# Altium project LightControl_PowerBoard.PrjPcb (part 1 of 2)
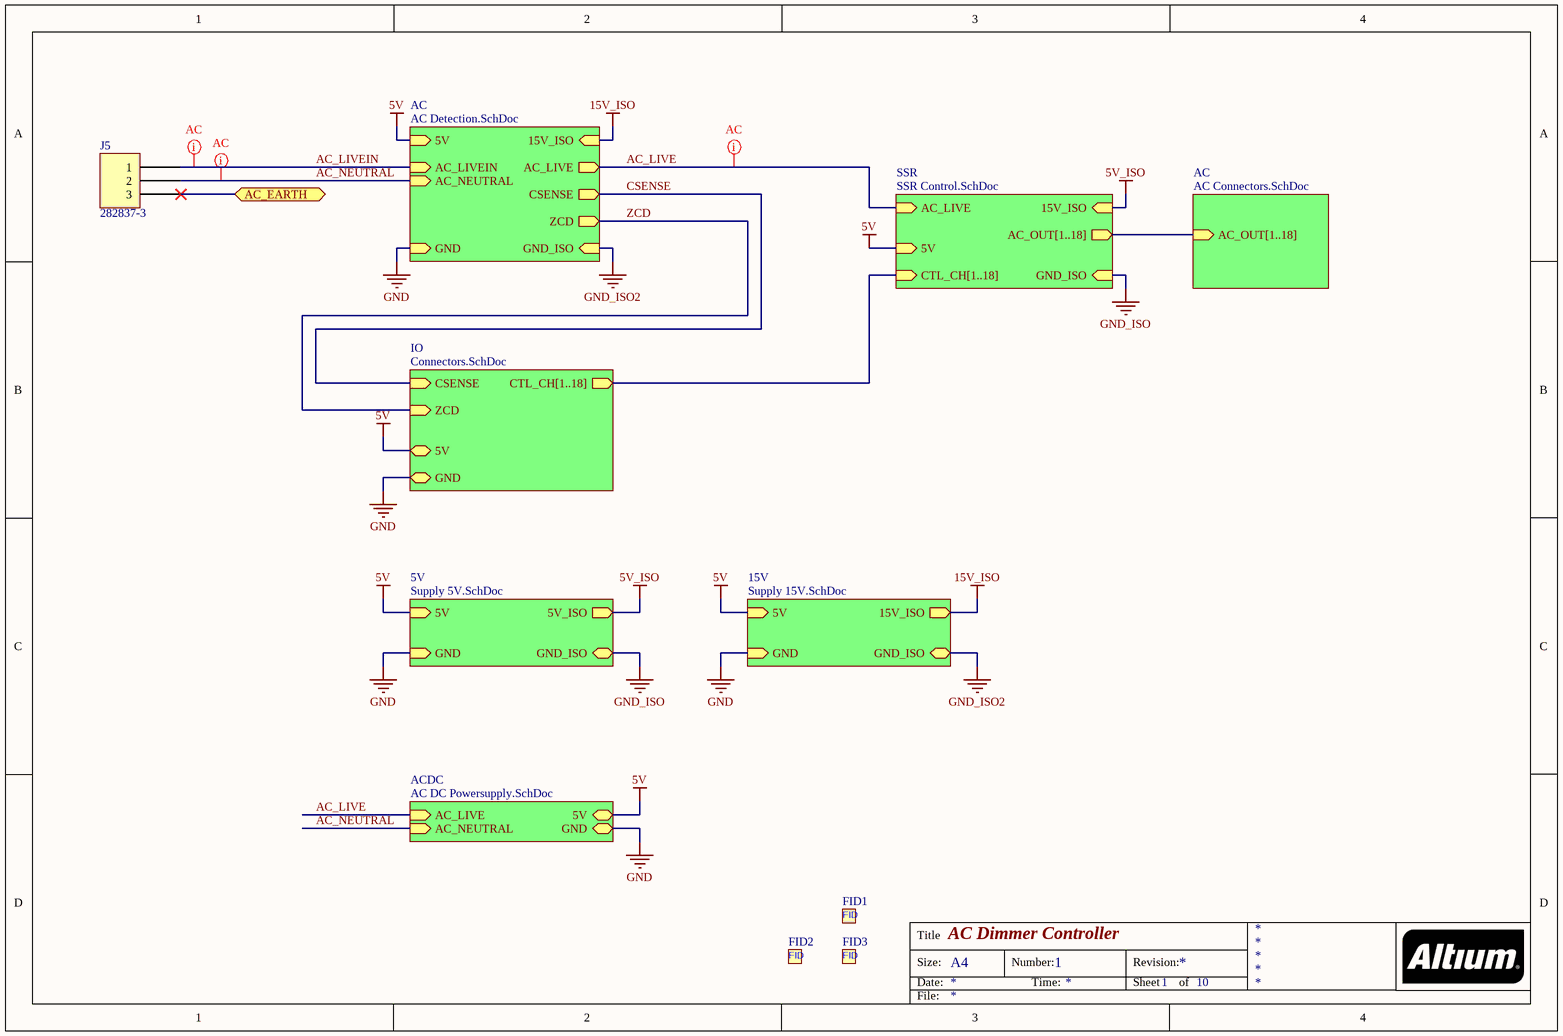
[diagram p0: Review.SchDoc]
10 sheets, 118 parts. Net scope: hierarchical (ports join the sheet entries above them; power ports are global).
Board files: LightControl_PowerBoard.PcbDoc, Power Board Panel 2 Up.PcbDoc
Sheets:
  Review.SchDoc
    AC = AC Detection.SchDoc
    5V = Supply 5V.SchDoc
    15V = Supply 15V.SchDoc
    SSR = SSR Control.SchDoc
      SSR1 = SSR.SchDoc
      SSR2 = SSR.SchDoc
      SSR3 = SSR.SchDoc
      SSR4 = SSR.SchDoc
      SSR5 = SSR.SchDoc
      SSR6 = SSR.SchDoc
      SSR7 = SSR.SchDoc
      SSR8 = SSR.SchDoc
      SSR9 = SSR.SchDoc
      SSR10 = SSR.SchDoc
      SSR11 = SSR.SchDoc
      SSR12 = SSR.SchDoc
      SSR13 = SSR.SchDoc
      SSR14 = SSR.SchDoc
      SSR15 = SSR.SchDoc
      SSR16 = SSR.SchDoc
      SSR17 = SSR.SchDoc
      SSR18 = SSR.SchDoc
      O0 = Opto.SchDoc
      O1 = Opto.SchDoc
      O2 = Opto.SchDoc
      O3 = Opto.SchDoc
      O4 = Opto.SchDoc
    AC = AC Connectors.SchDoc
    IO = Connectors.SchDoc
    ACDC = AC DC Powersupply.SchDoc

## Sheet Review.SchDoc: AC Dimmer Controller
size A4; DocumentNumber: 1; SheetNumber: 1; SheetTotal: 10

### Parts
FID1  Fiducial  [Fiducial-1mm]  (value not drawn)  (no BOM)
FID2  Fiducial  [Fiducial-1mm]  (value not drawn)  (no BOM)
FID3  Fiducial  [Fiducial-1mm]  (value not drawn)  (no BOM)
J5  282837-3  [TE 282837-3]

### Sub-sheets
5V = Supply 5V.SchDoc: GND (in), 5V (in), 5V_ISO (out), GND_ISO (bidir)
15V = Supply 15V.SchDoc: GND_ISO (bidir), 15V_ISO (out), 5V (in), GND (in)
AC = AC Detection.SchDoc: CSENSE (out), AC_LIVE (out), AC_LIVEIN (in), AC_NEUTRAL (in), ZCD (out), 15V_ISO (in), GND_ISO (in), GND (in), 5V (in)
AC = AC Connectors.SchDoc: AC_OUT[1..18] (in)
ACDC = AC DC Powersupply.SchDoc: AC_LIVE (in), AC_NEUTRAL (in), GND (bidir), 5V (bidir)
IO = Connectors.SchDoc: ZCD (in), CSENSE (in), CTL_CH[1..18] (out), 5V (bidir), GND (bidir)
SSR = SSR Control.SchDoc: CTL_CH[1..18] (in), AC_OUT[1..18] (out), AC_LIVE (in), 5V (in), 15V_ISO (in), GND_ISO (in)

### Ports
AC_EARTH (bidir)

### Nets
5V: sheet AC/5V, sheet 5V/5V, sheet 15V/5V, sheet SSR/5V, sheet IO/5V, sheet ACDC/5V
15V_ISO: sheet AC/15V_ISO, sheet 5V/5V_ISO, sheet 15V/15V_ISO, sheet SSR/15V_ISO  [also labelled 5V_ISO]
GND: sheet AC/GND, sheet 5V/GND, sheet 15V/GND, sheet IO/GND, sheet ACDC/GND
GND_ISO: sheet AC/GND_ISO, sheet 5V/GND_ISO, sheet 15V/GND_ISO, sheet SSR/GND_ISO  [also labelled GND_ISO2]
AC_LIVE: sheet AC/AC_LIVE, sheet SSR/AC_LIVE, sheet ACDC/AC_LIVE
AC_LIVEIN: J5.1 ; sheet AC/AC_LIVEIN
AC_NEUTRAL: J5.2 ; sheet AC/AC_NEUTRAL, sheet ACDC/AC_NEUTRAL
CSENSE: sheet AC/CSENSE, sheet IO/CSENSE
ZCD: sheet AC/ZCD, sheet IO/ZCD
NetJ5_3: J5.3 ; port AC_EARTH

### Buses and harness runs
bus sheet AC/AC_OUT[1..18] = sheet SSR/AC_OUT[1..18]
bus sheet IO/CTL_CH[1..18] = sheet SSR/CTL_CH[1..18]

### Layout directives
net class AC: AC_LIVE, AC_LIVEIN, AC_NEUTRAL

### Notes on the sheet
- Title
- Size:
- Date:
- A4
- Number:
- Time:
- Revision:
- Sheet
- of
- File:
- (in symbol Fiducial) FID

### Library data of the parts
J5 = 282837-3: TERM BLK 3P SIDE ENT 5.08MM PCB; Manufacturer: TE Connectivity AMP Connectors; Current: 13.5 A; Mating Orientation: Horizontal with Board; Number of Levels: 1; Pitch: 0.200" (5.08mm); Positions Per Level: 3; Voltage: 300 V; Wire Gauge: 16-28 AWG; Wire Termination: Screw - Rising Cage Clamp; Part Number: 282837-3; Color: Green; ComponentLink1Description: Datasheet; ComponentLink1URL: https://www.te.com/commerce/DocumentDelivery/DDEController?Action=srchrtrv&DocNm=282837&DocType=Customer+Drawing&DocLang=English; ComponentLink2Description: DigiKey Link; ComponentLink2URL: https://www.digikey.com/en/products/detail/te-connectivity-amp-connectors/282837-3/2187974; Features: Interlocking (Side); LastUpdated: 6/21/2022 3:00:39 PM; Lifecycle Status: Active; Minimum Order: 1; Mounting Type: Through Hole; Packaging: Tray; Part Status: Active; Price: 0.47; Series: Buchanan; Supplier 1: DigiKey; Supplier Part Number 1: A113321-ND

## Sheet AC Detection.SchDoc: AC Detection
size A4; DocumentNumber: 4; SheetNumber: 6; SheetTotal: 10
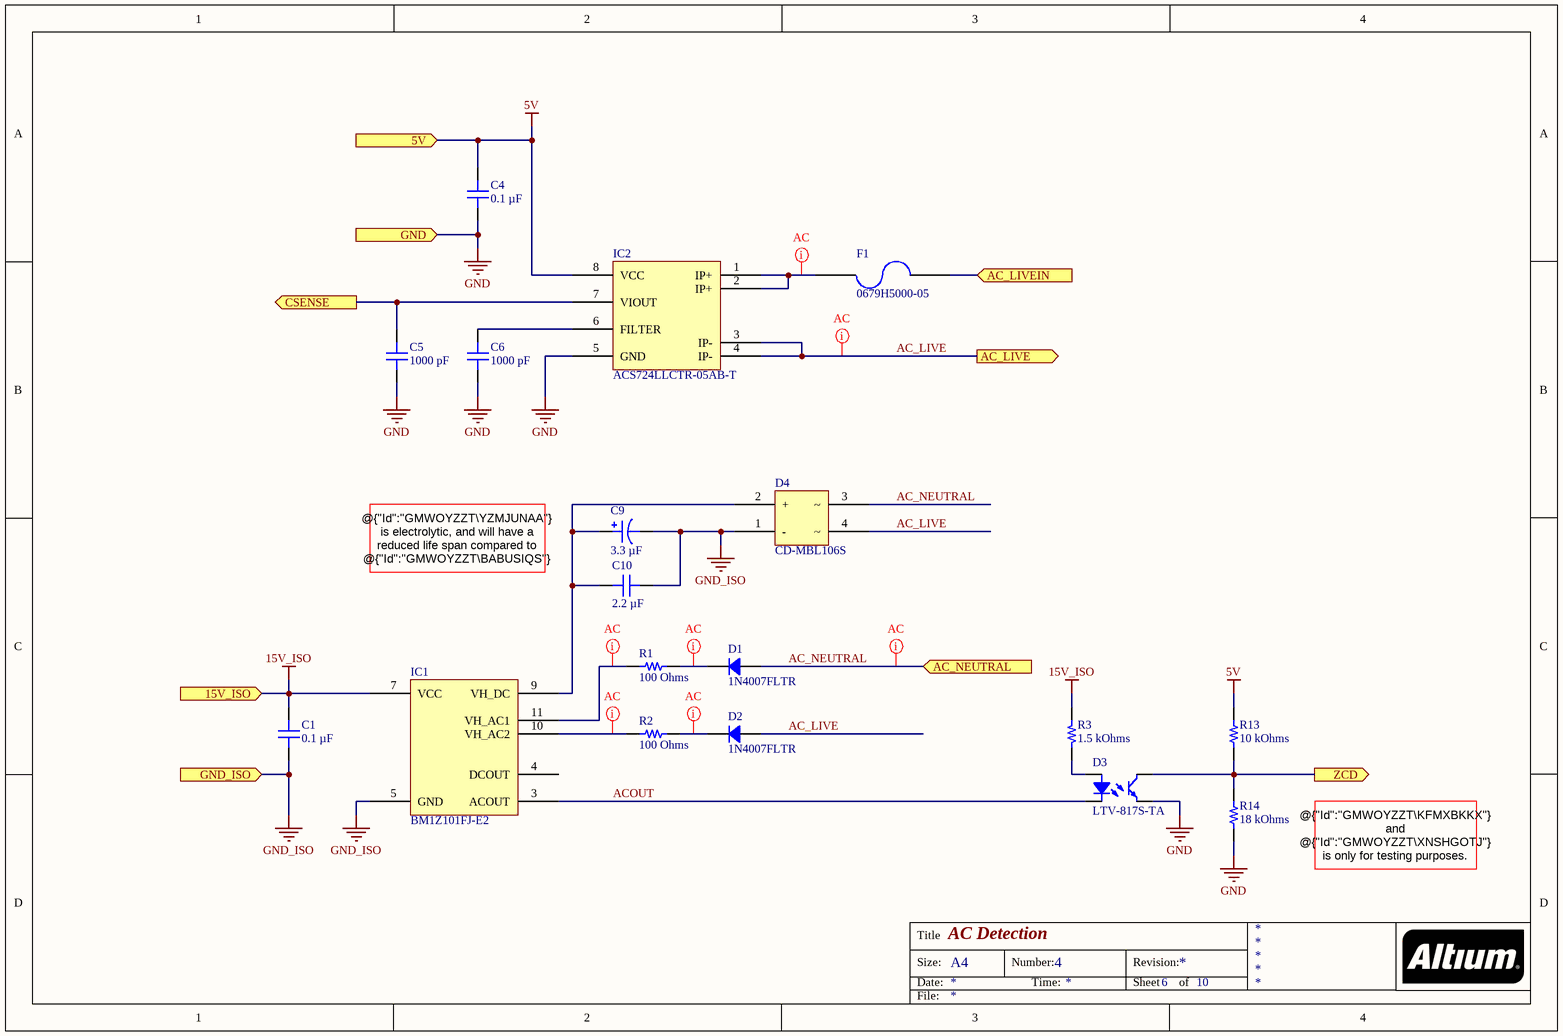
[diagram p1: AC Detection.SchDoc]

### Parts
C1  0.1 µF  [CAP 0603_1608]
C4  0.1 µF  [CAP 0603_1608]
C5  1000 pF  [CAP 0603_1608]
C6  1000 pF  [CAP 0603_1608]
C9  3.3 µF  [CAP ALSMD ELEC 8.3MM H11MM]
C10  2.2 µF  [CAP 2220_5650 3.0MM]
D1  1N4007FLTR  [SOD123F]
D2  1N4007FLTR  [SOD123F]
D3  LTV-817S-TA  [LITEON LTV-817]
D4  CD-MBL106S  [Bourns CD-MBL1xxS]
F1  0679H5000-05  [FUSE 2410_6125 2]
IC1  BM1Z101FJ-E2  [ROHM SOP-J11]
IC2  ACS724LLCTR-05AB-T  [ALLEGRO SOICN-8 LC]
R1  100 Ohms  [RES 1206_3216]
R2  100 Ohms  [RES 1206_3216]
R3  1.5 kOhms  [RES 0805_2012]
R13  10 kOhms  [RES 0603_1608]
R14  18 kOhms  [RES 0603_1608]

### Ports
5V (in, see Review[2A], AC DC Powersupply[3B], Connectors[3A], Opto[1B], SSR Control[1A], Supply 5V[2B], Supply 15V[2B]), 15V_ISO (in, see Review[2A], Supply 15V[3B]), AC_LIVE (out, see Review[2A], AC DC Powersupply[2B], SSR Control[3D], SSR[2B]), AC_LIVEIN (in, see Review[2A]), AC_NEUTRAL (in, see Review[2A], AC DC Powersupply[2B]), CSENSE (out, see Review[2A], Connectors[3C]), GND (in, see Review[2A], AC DC Powersupply[3B], Connectors[3D], Supply 5V[2C], Supply 15V[2C]), GND_ISO (in, see Review[2A], Supply 15V[3C]), ZCD (out, see Review[2A], Connectors[3D])

### Nets
5V: C4.2 IC2.8(VCC) R13.2 ; port 5V
15V_ISO: C1.2 IC1.7(VCC) R3.2 ; port 15V_ISO
GND: C4.1 C5.1 C6.1 D3.3 IC2.5(GND) R14.1 ; port GND
GND_ISO: C1.1 C9.2 C10.2 D4.1(-) IC1.5(GND) ; port GND_ISO
AC_LIVE: D2.1 D4.4 IC2.3(IP-) IC2.4(IP-) ; port AC_LIVE
AC_LIVEIN: F1.2 ; port AC_LIVEIN
AC_NEUTRAL: D1.1 D4.3 ; port AC_NEUTRAL
ACOUT: D3.2 IC1.3(ACOUT)
CSENSE: C5.2 IC2.7(VIOUT) ; port CSENSE
ZCD: D3.4 R13.1 R14.2 ; port ZCD
NetC6_2: C6.2 IC2.6(FILTER)
NetC9_1: C9.1 C10.1 D4.2(+) IC1.9(VH_DC)
NetD1_2: D1.2 R1.2
NetD2_2: D2.2 R2.2
NetD3_1: D3.1 R3.1
NetF1_1: F1.1 IC2.1(IP+) IC2.2(IP+)
NetIC1_10: IC1.10(VH_AC2) R2.1
NetIC1_11: IC1.11(VH_AC1) R1.1

Not connected (* = marked no-connect by the designer): IC1 4(DCOUT)

### Layout directives
net class AC: AC_LIVE, AC_NEUTRAL, NetD1_2, NetD2_2, NetF1_1, NetIC1_10, NetIC1_11

### Notes on the sheet
- @{"Id":"GMWOYZZT\YZMJUNAA"} is electrolytic, and will have a reduced life span compared to @{"Id":"GMWOYZZT\BABUSIQS"} which is ceramic. Choose one.
- @{"Id":"GMWOYZZT\KFMXBKKX"} and @{"Id":"GMWOYZZT\XNSHGOTJ"} is only for testing purposes. DNP/Remove if connected to control board.
- Title
- Size:
- Date:
- A4
- Number:
- Time:
- Revision:
- Sheet
- of
- File:

### Library data of the parts
C1 C4 = C0603C104K5RAC7411: CAP CER 0.1UF 50V X7R 0603; manufacturer: KEMET; Tolerance: ±10%; Part Number: C0603C104K5RAC7411; Value: 0.1 µF; Applications: Bypass, Decoupling; Capacitance: 0.1 µF; componentlink1description: Datasheet; componentlink1url: https://api.kemet.com/component-edge/download/datasheet/C0603C104K5RAC7411.pdf; componentlink2description: DigiKey Link; componentlink2url: https://www.digikey.com/en/products/detail/kemet/C0603C104K5RAC7411/3317013; Device Package: 0603 (1608 Metric); lastupdated: 5/3/2023 7:09:52 PM; Lifecycle Status: Active; Minimum Order: 1; Mounting Type: Surface Mount, MLCC; Operating Temperature: -55°C ~ 125°C; Package / Case: 0603 (1608 Metric); packaging: TapeAndReel; partid: 2233; Part Status: Active; price: 0.01; series: SMD Comm X7R; Size / Dimension: 0.063" L x 0.031" W (1.60mm x 0.80mm); Supplier 1: DigiKey; Supplier Part Number 1: 399-C0603C104K5RAC7411CT-ND; Temperature Coefficient: X7R; Thickness (Max): 0.035" (0.90mm); Voltage - Rated: 50V
C5 C6 = C0603X102K5RAC3316: CAP CER 0603 1NF 50V X7R 10%; manufacturer: KEMET; Part Number: C0603X102K5RAC3316; Value: 1000 pF; Applications: Automotive, Boardflex Sensitive; Capacitance: 1000 pF; componentlink1description: Datasheet; componentlink1url: https://api.kemet.com/component-edge/download/datasheet/C0603X102K5RAC3316.pdf; componentlink2description: DigiKey Link; componentlink2url: https://www.digikey.com/en/products/detail/kemet/C0603X102K5RAC3316/10315783; Device Package: 0603 (1608 Metric); Features: Soft Termination; lastupdated: 5/20/2023 7:10:23 PM; Lifecycle Status: Active; Minimum Order: 1; Mounting Type: Surface Mount, MLCC; Operating Temperature: -55°C ~ 125°C; Package / Case: 0603 (1608 Metric); packaging: TapeAndReel; partid: 16694; Part Status: Active; price: 0.06; Ratings: AEC-Q200; series: SMD Auto X7R VW80808; Size / Dimension: 0.063" L x 0.031" W (1.60mm x 0.80mm); Supplier 1: DigiKey; Supplier Part Number 1: 399-C0603X102K5RAC3316CT-ND; Temperature Coefficient: X7R; Thickness (Max): 0.037" (0.95mm); Tolerance: ±10%; Voltage - Rated: 50V
C9 = ULV2W3R3MNL1GS: CAP ALUM 3.3UF 20% 450V SMD; manufacturer: Nichicon; Lifetime @ Temp.: 10000 Hrs @ 105°C; Polarization: Polar; Ripple Current @ High Frequency: 40 mA @ 10 kHz; Ripple Current @ Low Frequency: 25 mA @ 120 Hz; Surface Mount Land Size: 0.327" L x 0.327" W (8.30mm x 8.30mm); Part Number: ULV2W3R3MNL1GS; Applications: General Purpose; Capacitance: 3.3 µF; componentlink1description: Datasheet; componentlink1url: http://nichicon-us.com/english/products/pdfs/e-ulv.pdf; componentlink2description: DigiKey Link; componentlink2url: https://www.digikey.com/en/products/detail/nichicon/ULV2W3R3MNL1GS/3664124; Device Package: Radial, Can - SMD; Height - Seated (Max): 0.433" (11.00mm); lastupdated: 15/09/2023 06:27:11; Lifecycle Status: Active; Minimum Order: 1; Mounting Type: Surface Mount; Operating Temperature: -40°C ~ 105°C; Package / Case: Radial, Can - SMD; packaging: TapeAndReel; partid: 28417; Part Status: Active; price: 0.32; series: ULV; Size / Dimension: 0.315" Dia (8.00mm); Supplier 1: DigiKey; Supplier Part Number 1: 493-6744-1-ND; Tolerance: ±20%; value: 3.3 µF; Voltage - Rated: 450 V
C10 = C5750X6S2W225K250KA: CAP CER 2.2UF 450V X6S 2220; manufacturer: TDK Corporation; Tolerance: ±10%; Part Number: C5750X6S2W225K250KA; Value: 2.2 µF; Applications: General Purpose; Capacitance: 2.2 µF; componentlink1description: Datasheet; componentlink1url: https://product.tdk.com/info/en/catalog/datasheets/mlcc_commercial_midvoltage_en.pdf?ref_disty=digikey; componentlink2description: DigiKey Link; componentlink2url: https://www.digikey.com/en/products/detail/tdk-corporation/C5750X6S2W225K250KA/2733216; Device Package: 2220 (5650 Metric); lastupdated: 16/10/2023 16:52:27; Lifecycle Status: Active; Minimum Order: 1; Mounting Type: Surface Mount, MLCC; Operating Temperature: -55°C ~ 105°C; Package / Case: 2220 (5650 Metric); packaging: TapeAndReel; Part Status: Active; price: 1.12; series: C; Size / Dimension: 0.224" L x 0.197" W (5.70mm x 5.00mm); Supplier 1: DigiKey; Supplier Part Number 1: 445-7781-1-ND; Temperature Coefficient: X6S; Thickness (Max): 0.110" (2.80mm); Voltage - Rated: 450V
D1 D2 = 1N4007FLTR: STANDARD RECTIFIER 1000V SOD-123; Manufacturer: SMC Diode Solutions; Capacitance @ Vr, F: 15pF @ 4V, 1MHz; Current - Average Rectified (Io): 1A; Current - Reverse Leakage @ Vr: 5µA @ 1000V; Speed: Standard Recovery >500ns, > 200mA (Io); Voltage - Forward (Vf) (Max) @ If: 1.1V @ 1A; Part Number: 1N4007FLTR; ComponentLink1Description: Datasheet; ComponentLink1URL: http://www.smc-diodes.com/propdf/1N4001FL-1N4007FL%20N1646%20REV.A.pdf; ComponentLink2Description: DigiKey Link; ComponentLink2URL: http://digikey.com/product-detail/en/smc-diode-solutions/1N4007FLTR/1655-1N4007FLCT-ND/11657827; Diode Type: Standard; LastUpdated: 8/30/2020 8:59:55 PM; Lifecycle Status: Active; Minimum Order: 1; Mounting Type: Surface Mount; Package / Case: SOD-123F; Packaging: TapeAndReel; PartId: 3314; Price: 0.01; Supplier 1: DigiKey; Supplier Part Number 1: 1655-1N4007FLCT-ND; Supplier Device Package: SOD-123FL; Voltage - DC Reverse (Vr) (Max): 1000V
D3 = LTV-817S-TA: OPTOISOLATR 5KV TRANSISTOR 4-SMD; Manufacturer: Lite-On Inc.; Current - DC Forward (If) (Max): 50mA; Current Transfer Ratio (Max): 600% @ 5mA; Current Transfer Ratio (Min): 50% @ 5mA; Input Type: DC; Number of Channels: 1; Rise / Fall Time (Typ): 4µs, 3µs; Vce Saturation (Max): 200mV; Voltage - Forward (Vf) (Typ): 1.2V; Voltage - Isolation: 5000Vrms; Voltage - Output (Max): 35V; Part Number: LTV-817S-TA; ComponentLink1Description: Datasheet; ComponentLink1URL: http://optoelectronics.liteon.com/upload/download/DS-70-96-0016/LTV-8X7%20series%20201610%20.pdf; ComponentLink2Description: DigiKey Link; ComponentLink2URL: http://digikey.com/product-detail/en/lite-on-inc/LTV-817S-TA/160-2038-1-ND/3711420; Current - Output / Channel: 50mA; Device Package: 4-SMD, Gull Wing; LastUpdated: 1/12/2020 9:59:02 PM; Lifecycle Status: Active; Minimum Order: 1; Mounting Type: Surface Mount; Operating Temperature: -30°C ~ 110°C; Output Type: Transistor; Package / Case: 4-SMD, Gull Wing; Packaging: TapeAndReel; Part Status: Active; Price: 0.12; Series: -; Supplier 1: DigiKey; Supplier Part Number 1: 160-2038-1-ND; Supplier Device Package: 4-SMD
D4 = CD-MBL106S: BRIDGE RECT 1PHASE 600V 1A; Manufacturer: Bourns Inc.; Current - Reverse Leakage @ Vr: 5 µA @ 600 V; Diode Type: Single Phase; Voltage - Forward (Vf) (Max) @ If: 1 V @ 1 A; ComponentLink1Description: Datasheet; ComponentLink1URL: https://www.bourns.com/docs/Product-Datasheets/cd-mbl1xxs.pdf; ComponentLink2Description: DigiKey Link; ComponentLink2URL: https://www.digikey.com/en/products/detail/bourns-inc/CD-MBL106S/7067520; Current - Average Rectified (Io): 1 A; Device Package: Chip, Concave Terminals; LastUpdated: 02/07/2023 12:12:09; Lifecycle Status: Active; Part Number: CD-MBL106S; Minimum Order: 1; Mounting Type: Surface Mount; Operating Temperature: -55°C ~ 175°C (TJ); Package / Case: Chip, Concave Terminals; Packaging: TapeAndReel; Part Status: Active; Price: 0.11; Series: -; Supplier 1: DigiKey; Supplier Part Number 1: CD-MBL106SCT-ND; Technology: Standard; Voltage - Peak Reverse (Max): 600 V
F1 = 0679H5000-05: FUSE BOARD MNT 5A 350VAC 60VDC; Manufacturer: Bel Fuse Inc.; Approval Agency: cURus; Breaking Capacity @ Rated Voltage: 50A AC, 150A DC; Fuse Type: Board Mount (Cartridge Style Excluded); Melting I²t: 5.5; Response Time: Fast Blow; Voltage Rating - AC: 350V; Voltage Rating - DC: 60V; Supplier 1: DigiKey; Supplier Part Number 1: 507-2054-1-ND; Part Number: 0679H5000-05; Approvals: cURus; ComponentLink1Description: Datasheet; ComponentLink1URL: https://www.belfuse.com/resources/CircuitProtection/datasheets/0679H%20Jan%202017.pdf; ComponentLink2Description: DigiKey Link; ComponentLink2URL: http://digikey.com/product-detail/en/bel-fuse-inc/0679H5000-05/507-2054-1-ND/6139818; Current Rating (Amps): 5A; LastUpdated: 5/31/2023 6:45:01 PM; Lifecycle Status: Active; Minimum Order: 1; Mounting Type: Surface Mount; Operating Temperature: -55°C ~ 125°C; Package / Case: 2-SMD, Square End Block; Packaging: TapeAndReel; Part Status: Active; Price: 0.14; Series: 0679H; Size / Dimension: 0.240" L x 0.100" W x 0.110" H (6.10mm x 2.54mm x 2.79mm)
IC1 = BM1Z101FJ-E2: IC SUPERVISOR 1 CHANNEL 11SOP; Manufacturer: Rohm Semiconductor; Number of Voltages Monitored: 1; Output: Open Drain or Open Collector; Part Number: BM1Z101FJ-E2; ComponentLink1Description: Datasheet; ComponentLink1URL: https://fscdn.rohm.com/en/products/databook/datasheet/ic/power/isolated_converter/bm1z101fj-e.pdf; ComponentLink2Description: DigiKey Link; ComponentLink2URL: https://www.digikey.com/en/products/detail/rohm-semiconductor/BM1Z101FJ-E2/13532560; LastUpdated: 5/17/2023 7:02:57 AM; Lifecycle Status: Active; Minimum Order: 1; Mounting Type: Surface Mount; Operating Temperature: -40°C ~ 105°C; Packaging: TapeAndReel; Part Status: Active; Price: 1.87; Series: -; Supplier 1: DigiKey; Supplier Part Number 1: 846-BM1Z101FJ-E2CT-ND; Supplier Device Package: 11-SOP-J; Type: Voltage Detector
IC2 = ACS724LLCTR-05AB-T: SENSOR CURRENT HALL 5A 8SOIC; Manufacturer: Allegro MicroSystems; Accuracy: ±0.6%; Current - Supply (Max): 14mA; For Measuring: AC/DC; Frequency: DC ~ 120kHz; Linearity: ±1.5%; Number of Channels: 1; Output: Ratiometric, Voltage; Polarization: Bidirectional; Response Time: 4µs; Sensitivity: 400mV/A; Sensor Type: Hall Effect, Open Loop; Voltage - Supply: 4.5V ~ 5.5V; Part Number: ACS724LLCTR-05AB-T; ComponentLink1Description: Datasheet; ComponentLink1URL: https://www.allegromicro.com/~/media/Files/Datasheets/ACS724-Datasheet.ashx; ComponentLink2Description: DigiKey Link; ComponentLink2URL: https://www.digikey.com/en/products/detail/allegro-microsystems/ACS724LLCTR-05AB-T/5400755; Current - Sensing: 5A; LastUpdated: 20/06/2023 21:01:40; Lifecycle Status: Active; Minimum Order: 1; Mounting Type: Surface Mount; Operating Temperature: -40°C ~ 150°C; Package / Case: 8-SOIC (0.154", 3.90mm Width); Packaging: TapeAndReel; Part Status: Active; Price: 2.03; Series: -; Supplier 1: DigiKey; Supplier Part Number 1: 620-ACS724LLCTR-05AB-TCT-ND; Supplier Device Package: 8-SOIC
R1 R2 = SR1206JR-7T100RL: RES 100 OHM 5% 3/4W 1206; Manufacturer: Yageo; Power (Watts): 0.75W, 3/4W; Temperature Coefficient: ±100ppm/°C; Part Number: SR1206JR-7T100RL; ComponentLink1Description: Datasheet; ComponentLink1URL: http://www.yageo.com/NewPortal/_en/search/productDocs.jsp?YageoPartNumber=SR1206JR-7T100RL; ComponentLink2Description: DigiKey Link; ComponentLink2URL: https://www.digikey.com/en/products/detail/yageo/SR1206JR-7T100RL/9696434; Composition: Thick Film; Device Package: 1206 (3216 Metric); Features: Automotive AEC-Q200, Pulse Withstanding; Height - Seated (Max): 0.026" (0.65mm); LastUpdated: 5/20/2023 7:45:17 PM; Lifecycle Status: Active; Minimum Order: 1; Number of Terminations: 2; Operating Temperature: -55°C ~ 155°C; Package / Case: 1206 (3216 Metric); Packaging: TapeAndReel; PartId: 27331; Part Status: Active; Price: 0.09; Ratings: AEC-Q200; Resistance: 100 Ohms; Series: SR; Size / Dimension: 0.122" L x 0.063" W (3.10mm x 1.60mm); Supplier 1: DigiKey; Supplier Part Number 1: YAG6196CT-ND; Supplier Device Package: 1206; Tolerance: ±5%; Value: 100 Ohms
R3 = CRGP0805F1K5: RES 1.5K OHM 1% 1/3W 0805; Manufacturer: TE Connectivity Passive Product; Power (Watts): 0.333W, 1/3W; Temperature Coefficient: ±100ppm/°C; Part Number: CRGP0805F1K5; Value: 1.5 kOhms; ComponentLink1Description: Datasheet; ComponentLink1URL: https://www.te.com/commerce/DocumentDelivery/DDEController?Action=srchrtrv&DocNm=9-1773463-9&DocType=DS&DocLang=English; ComponentLink2Description: DigiKey Link; ComponentLink2URL: https://www.digikey.com/en/products/detail/te-connectivity-passive-product/CRGP0805F1K5/8577081; Composition: Thick Film; Device Package: 0805 (2012 Metric); Features: Pulse Withstanding; Height - Seated (Max): 0.026" (0.65mm); LastUpdated: 5/21/2023 7:41:51 PM; Lifecycle Status: Active; Minimum Order: 1; Number of Terminations: 2; Operating Temperature: -55°C ~ 155°C; Package / Case: 0805 (2012 Metric); Packaging: TapeAndReel; PartId: 28723; Part Status: Active; Price: 0.02; Resistance: 1.5 kOhms; Series: CRGP; Size / Dimension: 0.079" L x 0.049" W (2.00mm x 1.25mm); Supplier 1: DigiKey; Supplier Part Number 1: A130479CT-ND; Supplier Device Package: 0805; Tolerance: ±1%
R13 = SG73S1JTTD1002F: RES 10K OHM 1% 1/5W 0603; Manufacturer: KOA Speer Electronics, Inc.; Power (Watts): 0.2W, 1/5W; Temperature Coefficient: ±100ppm/°C; Part Number: SG73S1JTTD1002F; Value: 10 kOhms; ComponentLink1Description: Datasheet; ComponentLink1URL: http://www.koaspeer.com/catimages/Products/SG73S/SG73S.pdf; ComponentLink2Description: DigiKey Link; ComponentLink2URL: https://www.digikey.com/en/products/detail/koa-speer-electronics-inc/SG73S1JTTD1002F/10279969; Composition: Thick Film; Device Package: 0603 (1608 Metric); Features: Automotive AEC-Q200, Moisture Resistant, Pulse Withstanding; Height - Seated (Max): 0.022" (0.55mm); LastUpdated: 6/13/2023 8:14:59 PM; Lifecycle Status: Active; Minimum Order: 1; Number of Terminations: 2; Operating Temperature: -55°C ~ 155°C; Package / Case: 0603 (1608 Metric); Packaging: TapeAndReel; PartId: 5386; Part Status: Active; Price: 0.01; Ratings: AEC-Q200; Resistance: 10 kOhms; Series: SG73S; Size / Dimension: 0.063" L x 0.031" W (1.60mm x 0.80mm); Supplier 1: DigiKey; Supplier Part Number 1: 2019-SG73S1JTTD1002FCT-ND; Supplier Device Package: 0603; Tolerance: ±1%
R14 = RC0603FR-1318KL: RES 18K OHM 1% 1/10W 0603; Manufacturer: Yageo; Power (Watts): 0.1W, 1/10W; Temperature Coefficient: ±100ppm/°C; Part Number: RC0603FR-1318KL; Value: 18 kOhms; ComponentLink1Description: Datasheet; ComponentLink1URL: https://www.yageo.com/upload/media/product/productsearch/datasheet/rchip/PYu-RC_Group_51_RoHS_L_11.pdf; ComponentLink2Description: DigiKey Link; ComponentLink2URL: https://www.digikey.com/en/products/detail/yageo/RC0603FR-1318KL/14286633; Composition: Thick Film; Device Package: 0603 (1608 Metric); Height - Seated (Max): 0.022" (0.55mm); LastUpdated: 15/10/2023 19:32:12; Lifecycle Status: Active; Minimum Order: 1; Number of Terminations: 2; Operating Temperature: -55°C ~ 155°C; Package / Case: 0603 (1608 Metric); Packaging: CutTape; PartId: 65513; Part Status: Active; Price: 0.01; Resistance: 18 kOhms; Series: RC_L; Size / Dimension: 0.063" L x 0.031" W (1.60mm x 0.80mm); Supplier 1: DigiKey; Supplier Part Number 1: 13-RC0603FR-1318KLCT-ND; Supplier Device Package: 0603; Tolerance: ±1%

## Sheet Supply 5V.SchDoc: 5V Isolated Supply
size A4; DocumentNumber: 8; SheetNumber: 8; SheetTotal: 9
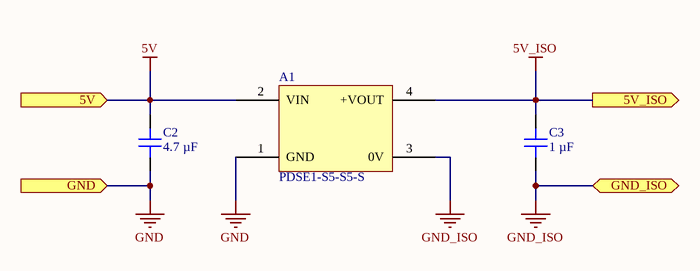
[diagram p2: Supply 5V.SchDoc]

### Parts
A1  PDSE1-S5-S5-S  [CUI PDSE1-S]
C2  4.7 µF  [CAP 0805_2012]
C3  1 µF  [CAP 0805_2012]

### Ports
5V (in, see Review[2C], AC current measurement[1A], Connectors[3A], Opto[1B], SSR_switch[1A], Supply 15V[2B]), 5V_ISO (out, see Review[2C]), GND (in, see Review[2C], AC current measurement[1B], Connectors[3D], Supply 15V[2C]), GND_ISO (bidir, see Review[2C], AC current measurement[1D], Opto[2B], SSR_switch[1B], Supply 15V[3C])

### Nets
5V: A1.2(VIN) C2.2 ; port 5V
5V_ISO: A1.4(+VOUT) C3.2 ; port 5V_ISO  [project net 15V_ISO]
GND: A1.1(GND) C2.1 ; port GND
GND_ISO: A1.3(0V) C3.1 ; port GND_ISO

### Notes on the sheet
- Title
- Size:
- Date:
- A4
- Number:
- Time:
- Revision:
- Sheet
- of
- File:

### Library data of the parts
A1 = PDSE1-S5-S5-S: DC DC CONVERTER 5V 1W; Manufacturer: CUI Inc.; Current - Output (Max): 200mA; Efficiency: 82%; Number of Outputs: 1; Voltage - Input (Max): 5.5V; Voltage - Input (Min): 4.5V; Voltage - Isolation: 3 kV; Part Number: PDSE1-S5-S5-S; Applications: ITE (Commercial); ComponentLink1Description: Datasheet; ComponentLink1URL: https://www.cui.com/product/resource/digikeypdf/pdse1-s.pdf; ComponentLink2Description: DigiKey Link; ComponentLink2URL: https://www.digikey.com/en/products/detail/cui-inc/PDSE1-S5-S5-S/10229826; Features: SCP; LastUpdated: 6/15/2023 9:01:19 PM; Lifecycle Status: Active; Minimum Order: 1; Mounting Type: Through Hole; Operating Temperature: -40°C ~ 105°C (With Derating); Package / Case: 4-SIP Module; Packaging: Tube; PartId: 58; Part Status: Active; Power (Watts): 1 W; Price: 1.62; Series: PDSE1-S (1W); Size / Dimension: 0.46" L x 0.24" W x 0.40" H (11.6mm x 6.0mm x 10.2mm); Supplier 1: DigiKey; Supplier Part Number 1: 102-6291-ND; Type: Isolated Module; Voltage - Output 1: 5V
C2 = CL21B475KAFNNNE: CAP CER 4.7UF 25V X7R 0805; manufacturer: Samsung Electro-Mechanics; Tolerance: ±10%; Part Number: CL21B475KAFNNNE; Value: 4.7 µF; Applications: General Purpose; Capacitance: 4.7 µF; componentlink1description: Datasheet; componentlink1url: http://www.samsungsem.com/kr/support/product-search/mlcc/CL21B475KAFNNNE.jsp; componentlink2description: DigiKey Link; componentlink2url: https://www.digikey.com/en/products/detail/samsung-electro-mechanics/CL21B475KAFNNNE/3888627; Device Package: 0805 (2012 Metric); lastupdated: 5/20/2023 7:17:56 PM; Lifecycle Status: Active; Minimum Order: 1; Mounting Type: Surface Mount, MLCC; Operating Temperature: -55°C ~ 125°C; Package / Case: 0805 (2012 Metric); packaging: TapeAndReel; partid: 3072; Part Status: Active; price: 0.08; series: CL; Size / Dimension: 0.079" L x 0.049" W (2.00mm x 1.25mm); Supplier 1: DigiKey; Supplier Part Number 1: 1276-2969-1-ND; Temperature Coefficient: X7R; Thickness (Max): 0.053" (1.35mm); Voltage - Rated: 25V
C3 = GCJ21BR71H105KA01L: CAP CER 1UF 50V X7R 0805; manufacturer: Murata Electronics; Tolerance: ±10%; Part Number: GCJ21BR71H105KA01L; Value: 1 µF; Applications: Automotive, Boardflex Sensitive; Capacitance: 1 µF; componentlink1description: Datasheet; componentlink1url: https://www.murata.com/~/media/webrenewal/support/library/catalog/products/capacitor/mlcc/c03e.ashx?la=en-us; componentlink2description: DigiKey Link; componentlink2url: https://www.digikey.com/en/products/detail/murata-electronics/GCJ21BR71H105KA01L/4903512; Device Package: 0805 (2012 Metric); Features: Soft Termination; lastupdated: 5/12/2023 7:17:22 PM; Lifecycle Status: Active; Minimum Order: 1; Mounting Type: Surface Mount, MLCC; Operating Temperature: -55°C ~ 125°C; Package / Case: 0805 (2012 Metric); packaging: TapeAndReel; partid: 2709; Part Status: Active; price: 0.05; Ratings: AEC-Q200; series: GCJ; Size / Dimension: 0.079" L x 0.049" W (2.00mm x 1.25mm); Supplier 1: DigiKey; Supplier Part Number 1: 490-10667-1-ND; Temperature Coefficient: X7R; Thickness (Max): 0.057" (1.45mm); Voltage - Rated: 50V

## Sheet Supply 15V.SchDoc: 15V Isolated Supply
size A4; DocumentNumber: 9; SheetNumber: 9; SheetTotal: 10
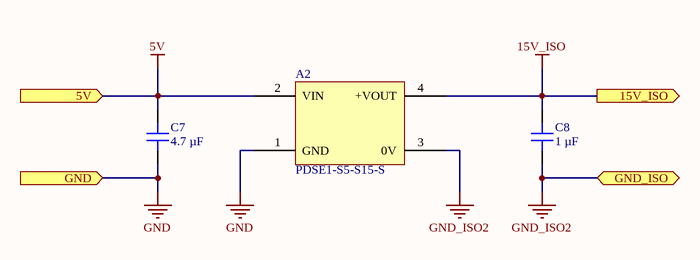
[diagram p3: Supply 15V.SchDoc]

### Parts
A2  PDSE1-S5-S15-S  [CUI PDSE1-S]
C7  4.7 µF  [CAP 0805_2012]
C8  1 µF  [CAP 0805_2012]

### Ports
5V (in, see Review[2C], AC DC Powersupply[3B], AC Detection[1A], Connectors[3A], Opto[1B], SSR Control[1A], Supply 5V[2B]), 15V_ISO (out, see Review[3C], AC Detection[1C]), GND (in, see Review[2C], AC DC Powersupply[3B], AC Detection[1A], Connectors[3D], Supply 5V[2C]), GND_ISO (bidir, see Review[3C], AC Detection[1D])

### Nets
5V: A2.2(VIN) C7.2 ; port 5V
15V_ISO: A2.4(+VOUT) C8.2 ; port 15V_ISO
GND: A2.1(GND) C7.1 ; port GND
GND_ISO2: A2.3(0V) C8.1 ; port GND_ISO  [project net GND_ISO]

### Notes on the sheet
- Title
- Size:
- Date:
- A4
- Number:
- Time:
- Revision:
- Sheet
- of
- File:

### Library data of the parts
A2 = PDSE1-S5-S15-S: DC DC CONVERTER 15V 1W; Manufacturer: CUI Inc.; Current - Output (Max): 67mA; Efficiency: 83%; Number of Outputs: 1; Voltage - Input (Max): 5.5V; Voltage - Input (Min): 4.5V; Voltage - Isolation: 1.5 kV; Part Number: PDSE1-S5-S15-S; Applications: ITE (Commercial); ComponentLink2Description: DigiKey Link; ComponentLink2URL: https://www.digikey.com/en/products/detail/cui-inc/PDSE1-S5-S15-S/10229829; Features: SCP; LastUpdated: 6/15/2023 9:01:19 PM; Lifecycle Status: Active; Minimum Order: 1; Mounting Type: Through Hole; Operating Temperature: -40°C ~ 105°C (With Derating); Package / Case: 4-SIP Module; Packaging: Tube; PartId: 57; Part Status: Active; Power (Watts): 1 W; Price: 1.79; Series: PDSE1-S (1W); Size / Dimension: 0.46" L x 0.24" W x 0.40" H (11.6mm x 6.0mm x 10.2mm); Supplier 1: DigiKey; Supplier Part Number 1: 102-6294-ND; Type: Isolated Module; Voltage - Output 1: 15V
C7 = CL21B475KAFNNNE: as C2 on sheet Supply 5V; Part Number: CL21B475KAFNNNE; Value: 4.7 µF; Applications: General Purpose; Capacitance: 4.7 µF; componentlink1description: Datasheet; componentlink1url: http://www.samsungsem.com/kr/support/product-search/mlcc/CL21B475KAFNNNE.jsp; componentlink2description: DigiKey Link; componentlink2url: https://www.digikey.com/en/products/detail/samsung-electro-mechanics/CL21B475KAFNNNE/3888627; Device Package: 0805 (2012 Metric); lastupdated: 5/20/2023 7:17:56 PM; Lifecycle Status: Active; Minimum Order: 1; Mounting Type: Surface Mount, MLCC; Operating Temperature: -55°C ~ 125°C; Package / Case: 0805 (2012 Metric); packaging: TapeAndReel; partid: 3072; Part Status: Active; price: 0.08; series: CL; Size / Dimension: 0.079" L x 0.049" W (2.00mm x 1.25mm); Supplier 1: DigiKey; Supplier Part Number 1: 1276-2969-1-ND; Temperature Coefficient: X7R; Thickness (Max): 0.053" (1.35mm); Voltage - Rated: 25V
C8 = GCJ21BR71H105KA01L: as C3 on sheet Supply 5V; Part Number: GCJ21BR71H105KA01L; Value: 1 µF; Applications: Automotive, Boardflex Sensitive; Capacitance: 1 µF; componentlink1description: Datasheet; componentlink1url: https://www.murata.com/~/media/webrenewal/support/library/catalog/products/capacitor/mlcc/c03e.ashx?la=en-us; componentlink2description: DigiKey Link; componentlink2url: https://www.digikey.com/en/products/detail/murata-electronics/GCJ21BR71H105KA01L/4903512; Device Package: 0805 (2012 Metric); Features: Soft Termination; lastupdated: 5/12/2023 7:17:22 PM; Lifecycle Status: Active; Minimum Order: 1; Mounting Type: Surface Mount, MLCC; Operating Temperature: -55°C ~ 125°C; Package / Case: 0805 (2012 Metric); packaging: TapeAndReel; partid: 2709; Part Status: Active; price: 0.05; Ratings: AEC-Q200; series: GCJ; Size / Dimension: 0.079" L x 0.049" W (2.00mm x 1.25mm); Supplier 1: DigiKey; Supplier Part Number 1: 490-10667-1-ND; Temperature Coefficient: X7R; Thickness (Max): 0.057" (1.45mm); Voltage - Rated: 50V

## Sheet SSR Control.SchDoc: SSR Control
size A4; DocumentNumber: 3; SheetNumber: 3; SheetTotal: 9
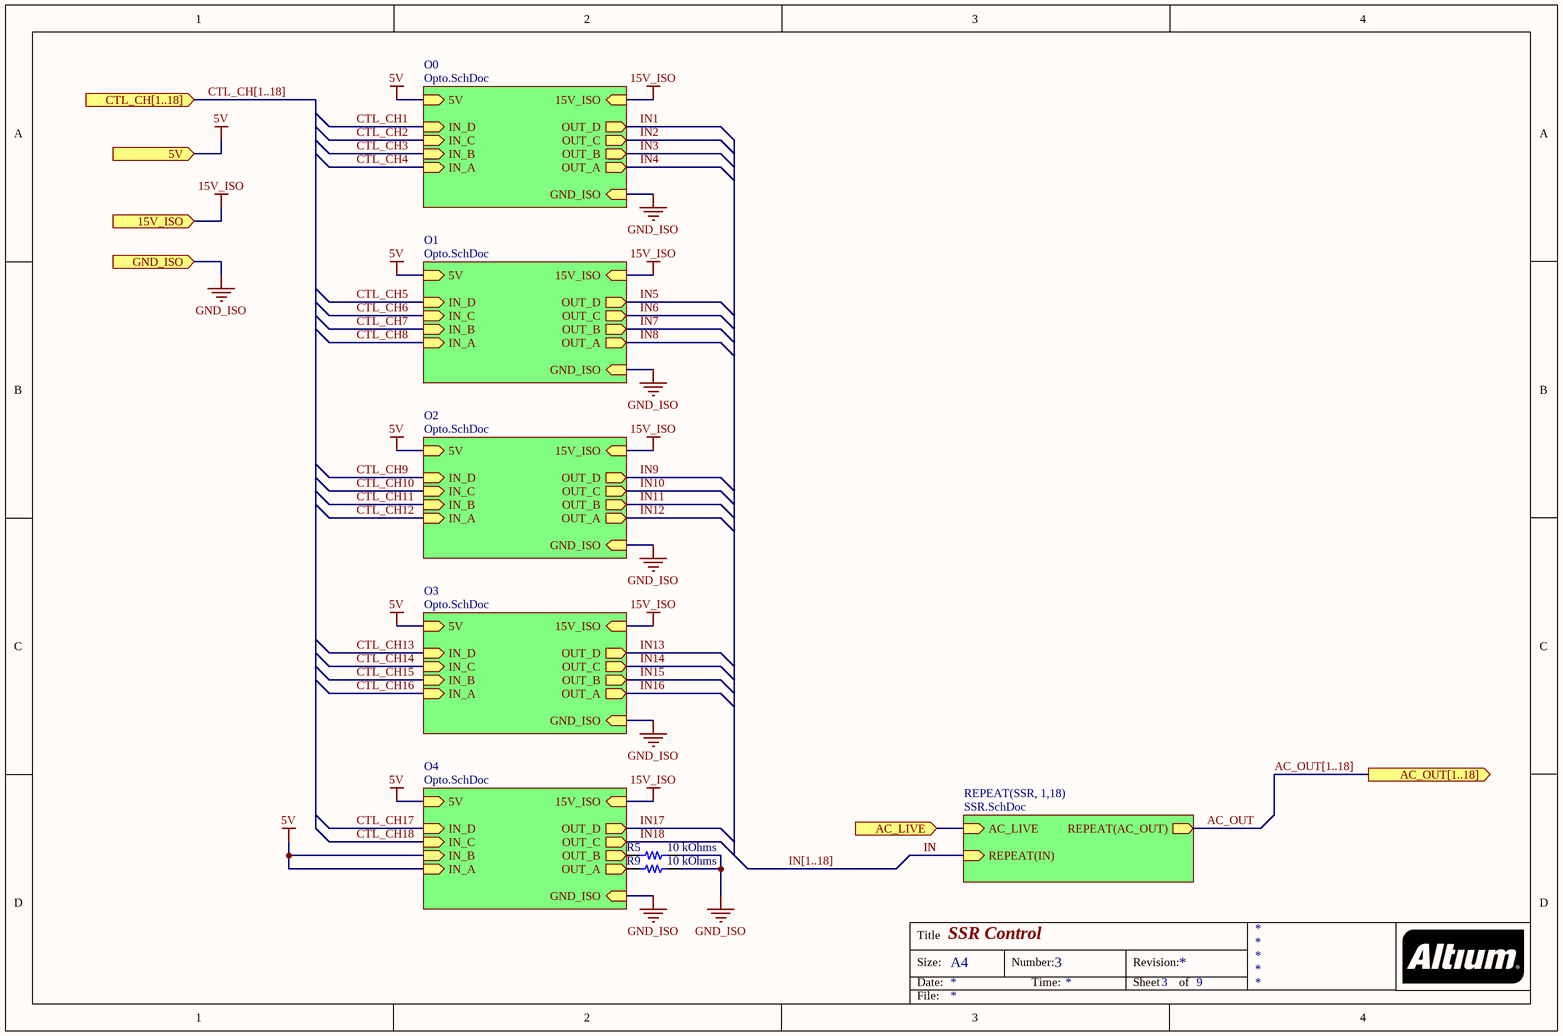
[diagram p4: SSR Control.SchDoc]

### Parts
R5  10 kOhms  [RES 0603_1608]
R9  10 kOhms  [RES 0603_1608]

### Sub-sheets
O0 = Opto.SchDoc: IN_A (in), IN_D (in), IN_C (in), IN_B (in), OUT_C (out), OUT_D (out), OUT_B (out), OUT_A (out), 5V (in), 15V_ISO (in), GND_ISO (in)
O1 = Opto.SchDoc: IN_A (in), IN_D (in), IN_C (in), IN_B (in), OUT_C (out), OUT_D (out), OUT_B (out), OUT_A (out), 5V (in), 15V_ISO (in), GND_ISO (in)
O2 = Opto.SchDoc: IN_A (in), IN_D (in), IN_C (in), IN_B (in), OUT_C (out), OUT_D (out), OUT_B (out), OUT_A (out), 5V (in), 15V_ISO (in), GND_ISO (in)
O3 = Opto.SchDoc: IN_A (in), IN_D (in), IN_C (in), IN_B (in), OUT_C (out), OUT_D (out), OUT_B (out), OUT_A (out), 5V (in), 15V_ISO (in), GND_ISO (in)
O4 = Opto.SchDoc: IN_A (in), IN_D (in), IN_C (in), IN_B (in), OUT_C (out), OUT_D (out), OUT_B (out), OUT_A (out), 5V (in), 15V_ISO (in), GND_ISO (in)
REPEAT(SSR, 1,18) = SSR.SchDoc: AC_LIVE (in), REPEAT(AC_OUT) (out), REPEAT(IN) (in)

### Ports
5V (in, see Review[3A], AC Detection[1A], Connectors[3A], Opto[1B], Supply 5V[2B], Supply 15V[2B]), 15V_ISO (in, see Review[3A], Opto[2B]), AC_LIVE (in, see Review[3A], AC Detection[3B], SSR[2B]), AC_OUT[1..18] (out, see Review[3A], AC Connectors[2A]), CTL_CH[1..18] (in, see Review[3B], Connectors[3A]), GND_ISO (in, see Review[3B], Opto[2B], Supply 5V[3C])

### Nets
5V: port 5V, sheet O0/5V, sheet O1/5V, sheet O2/5V, sheet O3/5V, sheet O4/IN_A, sheet O4/IN_B, sheet O4/5V
15V_ISO: port 15V_ISO, sheet O0/15V_ISO, sheet O1/15V_ISO, sheet O2/15V_ISO, sheet O3/15V_ISO, sheet O4/15V_ISO
GND_ISO: R5.2 R9.2 ; port GND_ISO, sheet O0/GND_ISO, sheet O1/GND_ISO, sheet O2/GND_ISO, sheet O3/GND_ISO, sheet O4/GND_ISO
AC_LIVE: port AC_LIVE, sheet REPEAT(SSR, 1,18)/AC_LIVE
AC_OUT: sheet REPEAT(SSR, 1,18)/REPEAT(AC_OUT)
IN: sheet REPEAT(SSR, 1,18)/REPEAT(IN)
NetIC3_O4_14: R5.1 ; sheet O4/OUT_B
NetIC3_O4_16: R9.1 ; sheet O4/OUT_A

### Buses and harness runs
bus AC_OUT[1..18] = port AC_OUT[1..18]
bus CTL_CH[1..18] = port CTL_CH[1..18]
bus IN[1..18]

### Notes on the sheet
- Title
- Size:
- Date:
- A4
- Number:
- Time:
- Revision:
- Sheet
- of
- File:

### Library data of the parts
R5 R9 = SG73S1JTTD1002F: as R13 on sheet AC Detection; Part Number: SG73S1JTTD1002F; Value: 10 kOhms; ComponentLink1Description: Datasheet; ComponentLink1URL: http://www.koaspeer.com/catimages/Products/SG73S/SG73S.pdf; ComponentLink2Description: DigiKey Link; ComponentLink2URL: https://www.digikey.com/en/products/detail/koa-speer-electronics-inc/SG73S1JTTD1002F/10279969; Composition: Thick Film; Device Package: 0603 (1608 Metric); Features: Automotive AEC-Q200, Moisture Resistant, Pulse Withstanding; Height - Seated (Max): 0.022" (0.55mm); LastUpdated: 6/13/2023 8:14:59 PM; Lifecycle Status: Active; Minimum Order: 1; Number of Terminations: 2; Operating Temperature: -55°C ~ 155°C; Package / Case: 0603 (1608 Metric); Packaging: TapeAndReel; PartId: 5386; Part Status: Active; Price: 0.01; Ratings: AEC-Q200; Resistance: 10 kOhms; Series: SG73S; Size / Dimension: 0.063" L x 0.031" W (1.60mm x 0.80mm); Supplier 1: DigiKey; Supplier Part Number 1: 2019-SG73S1JTTD1002FCT-ND; Supplier Device Package: 0603; Tolerance: ±1%

## Sheet SSR.SchDoc: Solid State Relay
size A4; DocumentNumber: 6; SheetNumber: 5; SheetTotal: 9
Used 18 times, as channels SSR/SSR1, SSR/SSR2, SSR/SSR3, SSR/SSR4, SSR/SSR5, SSR/SSR6, SSR/SSR7, SSR/SSR8, SSR/SSR9, SSR/SSR10, SSR/SSR11, SSR/SSR12, SSR/SSR13, SSR/SSR14, SSR/SSR15, SSR/SSR16, SSR/SSR17, SSR/SSR18. Parts and nets are listed once, with the designators drawn on the sheet.
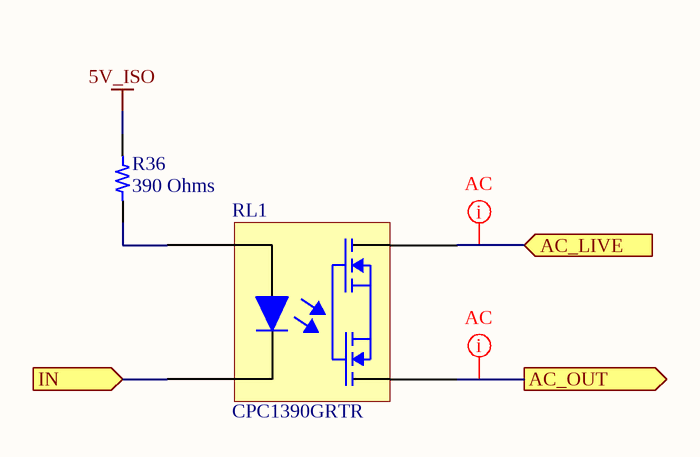
[diagram p5: SSR.SchDoc]

### Parts
R36  390 Ohms  [RES 0603_1608]
RL1  CPC1390GRTR  [IXYS SOP-4 CPC1390GR]

### Ports
AC_LIVE (in, see SSR_switch[3D], AC current measurement[3B], SSR_switch[3D]), AC_OUT (out, see SSR_switch[4D]), IN (in, see SSR_switch[3D])

### Nets
5V_ISO: R36.2
AC_LIVE: RL1.4 ; port AC_LIVE
AC_OUT: RL1.3 ; port AC_OUT
IN: RL1.2 ; port IN
NetR36_1: R36.1 RL1.1

### Channels
SSR/SSR1: designators end in _SSR1; ports AC_LIVE=AC_LIVE AC_OUT=AC_OUT1 IN=IN1
SSR/SSR2: designators end in _SSR2; ports AC_LIVE=AC_LIVE AC_OUT=AC_OUT2 IN=IN2
SSR/SSR3: designators end in _SSR3; ports AC_LIVE=AC_LIVE AC_OUT=AC_OUT3 IN=IN3
SSR/SSR4: designators end in _SSR4; ports AC_LIVE=AC_LIVE AC_OUT=AC_OUT4 IN=IN4
SSR/SSR5: designators end in _SSR5; ports AC_LIVE=AC_LIVE AC_OUT=AC_OUT5 IN=IN5
SSR/SSR6: designators end in _SSR6; ports AC_LIVE=AC_LIVE AC_OUT=AC_OUT6 IN=IN6
SSR/SSR7: designators end in _SSR7; ports AC_LIVE=AC_LIVE AC_OUT=AC_OUT7 IN=IN7
SSR/SSR8: designators end in _SSR8; ports AC_LIVE=AC_LIVE AC_OUT=AC_OUT8 IN=IN8
SSR/SSR9: designators end in _SSR9; ports AC_LIVE=AC_LIVE AC_OUT=AC_OUT9 IN=IN9
SSR/SSR10: designators end in _SSR10; ports AC_LIVE=AC_LIVE AC_OUT=AC_OUT10 IN=IN10
SSR/SSR11: designators end in _SSR11; ports AC_LIVE=AC_LIVE AC_OUT=AC_OUT11 IN=IN11
SSR/SSR12: designators end in _SSR12; ports AC_LIVE=AC_LIVE AC_OUT=AC_OUT12 IN=IN12
SSR/SSR13: designators end in _SSR13; ports AC_LIVE=AC_LIVE AC_OUT=AC_OUT13 IN=IN13
SSR/SSR14: designators end in _SSR14; ports AC_LIVE=AC_LIVE AC_OUT=AC_OUT14 IN=IN14
SSR/SSR15: designators end in _SSR15; ports AC_LIVE=AC_LIVE AC_OUT=AC_OUT15 IN=IN15
SSR/SSR16: designators end in _SSR16; ports AC_LIVE=AC_LIVE AC_OUT=AC_OUT16 IN=IN16
SSR/SSR17: designators end in _SSR17; ports AC_LIVE=AC_LIVE AC_OUT=AC_OUT17 IN=IN17
SSR/SSR18: designators end in _SSR18; ports AC_LIVE=AC_LIVE AC_OUT=AC_OUT18 IN=IN18

### Layout directives
net class AC: AC_LIVE, AC_OUT1

### Notes on the sheet
- Title
- Size:
- Date:
- A4
- Number:
- Time:
- Revision:
- Sheet
- of
- File:

### Library data of the parts
R36 = CRCW0603390RFKEAC: RES 390 OHM 1% 1/10W 0603; Manufacturer: Vishay Dale; Power (Watts): 0.1W, 1/10W; Temperature Coefficient: ±100ppm/°C; Part Number: CRCW0603390RFKEAC; Value: 390 Ohms; ComponentLink1Description: Datasheet; ComponentLink1URL: https://www.vishay.com/docs/28773/crcwce3.pdf; ComponentLink2Description: DigiKey Link; ComponentLink2URL: https://www.digikey.com/en/products/detail/vishay-dale/CRCW0603390RFKEAC/7924125; Composition: Thick Film; Device Package: 0603 (1608 Metric); Height - Seated (Max): 0.022" (0.55mm); LastUpdated: 6/13/2023 8:12:47 PM; Lifecycle Status: Active; Minimum Order: 1; Number of Terminations: 2; Operating Temperature: -55°C ~ 155°C; Package / Case: 0603 (1608 Metric); Packaging: CutTape; PartId: 65705; Part Status: Active; Price: 0.01; Resistance: 390 Ohms; Series: CRCW-C; Size / Dimension: 0.063" L x 0.031" W (1.60mm x 0.80mm); Supplier 1: DigiKey; Supplier Part Number 1: 541-5380-1-ND; Supplier Device Package: 0603; Tolerance: ±1%
RL1 = CPC1390GRTR: SSR RELAY SPST-NO 140MA 0-400V; Manufacturer: IXYS Integrated Circuits Division; Circuit: SPST-NO (1 Form A); On-State Resistance (Max): 22 Ohms; Output Type: AC, DC; Voltage - Input: 1.2VDC; Voltage - Load: 0 V ~ 400 V; ComponentLink1Description: Datasheet; ComponentLink1URL: http://www.ixysic.com/home/pdfs.nsf/0/9B95EEECA83780688525720B0055EE7F/$file/CPC1390.pdf; ComponentLink2Description: DigiKey Link; ComponentLink2URL: https://www.digikey.com/en/products/detail/ixys-integrated-circuits-division/CPC1390GRTR/1277123; LastUpdated: 6/14/2023 8:30:33 PM; Lifecycle Status: Active; Load Current: 140 mA; Part Number: CPC1390GRTR; Minimum Order: 1; Mounting Type: Surface Mount; Package / Case: 4-SMD (0.300", 7.62mm); Packaging: TapeAndReel; Part Status: Active; Price: 1.09; Series: CPC, OptoMOS®; Supplier 1: DigiKey; Supplier Part Number 1: CLA269CT-ND; Supplier Device Package: 4-SMD; Termination Style: Gull Wing

## Sheet Opto.SchDoc: Quad Optoisolator
size A4; DocumentNumber: 5; SheetNumber: 4; SheetTotal: 9
Used 5 times, as channels SSR/O0, SSR/O1, SSR/O2, SSR/O3, SSR/O4. Parts and nets are listed once, with the designators drawn on the sheet.
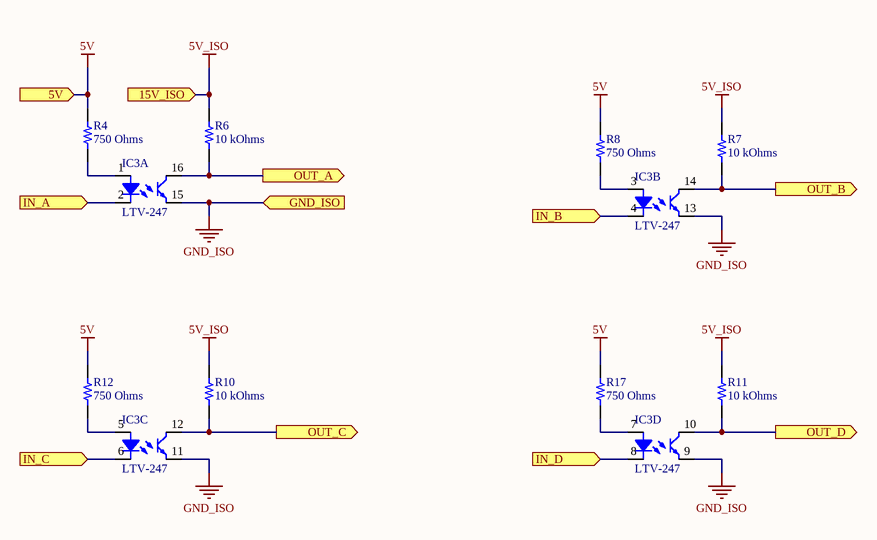
[diagram p6: Opto.SchDoc]

### Parts
IC3  LTV-247  [LITEON SOIC-16 LTV-247]  (parts A,B,C,D of 4)
R4  750 Ohms  [RES 0603_1608]
R6  10 kOhms  [RES 0603_1608]
R7  10 kOhms  [RES 0603_1608]
R8  750 Ohms  [RES 0603_1608]
R10  10 kOhms  [RES 0603_1608]
R11  10 kOhms  [RES 0603_1608]
R12  750 Ohms  [RES 0603_1608]
R17  750 Ohms  [RES 0603_1608]

### Ports
5V (in, see SSR_switch[2A], AC current measurement[1A], Connectors[3A], SSR_switch[1A], Supply 5V[2B], Supply 15V[2B]), 15V_ISO (in, see SSR_switch[2A], AC current measurement[1C], SSR_switch[1A]), GND_ISO (in, see SSR_switch[2A], AC current measurement[1D], SSR_switch[1B], Supply 5V[3C], Supply 15V[3C]), IN_A (in, see SSR_switch[2A]), IN_B (in, see SSR_switch[2A]), IN_C (in, see SSR_switch[2A]), IN_D (in, see SSR_switch[2A]), OUT_A (out, see SSR_switch[2A]), OUT_B (out, see SSR_switch[2A]), OUT_C (out, see SSR_switch[2A]), OUT_D (out, see SSR_switch[2A])

### Nets
5V: R4.2 R8.2 R12.1 R17.1 ; port 5V
5V_ISO: R6.2 R7.2 R10.2 R11.2 ; port 15V_ISO
GND_ISO: IC3.9 IC3.11 IC3.13 IC3.15 ; port GND_ISO
IN_A: IC3.2 ; port IN_A
IN_B: IC3.4 ; port IN_B
IN_C: IC3.6 ; port IN_C
IN_D: IC3.8 ; port IN_D
OUT_A: IC3.16 R6.1 ; port OUT_A
OUT_B: IC3.14 R7.1 ; port OUT_B
OUT_C: IC3.12 R10.1 ; port OUT_C
OUT_D: IC3.10 R11.1 ; port OUT_D
NetIC3_1: IC3.1 R4.1
NetIC3_3: IC3.3 R8.1
NetIC3_5: IC3.5 R12.2
NetIC3_7: IC3.7 R17.2

### Channels
SSR/O0: designators end in _O0; ports 5V=5V 15V_ISO=15V_ISO GND_ISO=GND_ISO IN_A=CTL_CH4 IN_B=CTL_CH3 IN_C=CTL_CH2 IN_D=CTL_CH1 OUT_A=IN4 OUT_B=IN3 OUT_C=IN2 OUT_D=IN1
SSR/O1: designators end in _O1; ports 5V=5V 15V_ISO=15V_ISO GND_ISO=GND_ISO IN_A=CTL_CH8 IN_B=CTL_CH7 IN_C=CTL_CH6 IN_D=CTL_CH5 OUT_A=IN8 OUT_B=IN7 OUT_C=IN6 OUT_D=IN5
SSR/O2: designators end in _O2; ports 5V=5V 15V_ISO=15V_ISO GND_ISO=GND_ISO IN_A=CTL_CH12 IN_B=CTL_CH11 IN_C=CTL_CH10 IN_D=CTL_CH9 OUT_A=IN12 OUT_B=IN11 OUT_C=IN10 OUT_D=IN9
SSR/O3: designators end in _O3; ports 5V=5V 15V_ISO=15V_ISO GND_ISO=GND_ISO IN_A=CTL_CH16 IN_B=CTL_CH15 IN_C=CTL_CH14 IN_D=CTL_CH13 OUT_A=IN16 OUT_B=IN15 OUT_C=IN14 OUT_D=IN13
SSR/O4: designators end in _O4; ports 5V=5V 15V_ISO=15V_ISO GND_ISO=GND_ISO IN_A=5V IN_B=5V IN_C=CTL_CH18 IN_D=CTL_CH17 OUT_A=NetIC3_O4_16 OUT_B=NetIC3_O4_14 OUT_C=IN18 OUT_D=IN17

### Notes on the sheet
- Title
- Size:
- Date:
- A4
- Number:
- Time:
- Revision:
- Sheet
- of
- File:

### Library data of the parts
IC3 = LTV-247: OPTOISO 3.75KV 4CH TRANS 16SO; Manufacturer: Lite-On Inc.; Current - DC Forward (If) (Max): 50mA; Current Transfer Ratio (Max): 600% @ 5mA; Current Transfer Ratio (Min): 50% @ 5mA; Input Type: DC; Number of Channels: 4; Output Type: Transistor; Rise / Fall Time (Typ): 2µs, 3µs; Turn On / Turn Off Time (Typ): 3µs, 3µs; Vce Saturation (Max): 400mV; Voltage - Forward (Vf) (Typ): 1.2V; Voltage - Isolation: 3750Vrms; Voltage - Output (Max): 80V; Part Number: LTV-247; ComponentLink1Description: Datasheet; ComponentLink1URL: http://optoelectronics.liteon.com/upload/download/DS70-2009-0014/LTV-2X7%20sereis%20Mar17.PDF; ComponentLink2Description: DigiKey Link; ComponentLink2URL: http://digikey.com/product-detail/en/lite-on-inc/LTV-247/160-2255-1-ND/8042559; Current - Output / Channel: 50mA; LastUpdated: 6/12/2023 2:51:07 PM; Lifecycle Status: Active; Minimum Order: 1; Mounting Type: Surface Mount; Operating Temperature: -55°C ~ 110°C; Package / Case: 16-SOIC (0.173", 4.40mm Width); Packaging: TapeAndReel; Part Status: Active; Price: 0.43; Series: -; Supplier 1: DigiKey; Supplier Part Number 1: 160-2255-1-ND; Supplier Device Package: 16-SO
R4 R8 R12 R17 = RMCF0603FT750R: RES 750 OHM 1% 1/10W 0603; Manufacturer: Stackpole Electronics Inc; Power (Watts): 0.1W, 1/10W; Temperature Coefficient: ±100ppm/°C; Part Number: RMCF0603FT750R; Value: 750 Ohms; ComponentLink1Description: Datasheet; ComponentLink1URL: https://www.seielect.com/catalog/sei-rmcf_rmcp.pdf; ComponentLink2Description: DigiKey Link; ComponentLink2URL: https://www.digikey.com/en/products/detail/stackpole-electronics-inc/RMCF0603FT750R/1761094; Composition: Thick Film; Device Package: 0603 (1608 Metric); Features: Automotive AEC-Q200; Height - Seated (Max): 0.022" (0.55mm); LastUpdated: 6/19/2023 7:42:15 PM; Lifecycle Status: Active; Minimum Order: 1; Number of Terminations: 2; Operating Temperature: -55°C ~ 155°C; Package / Case: 0603 (1608 Metric); Packaging: CutTape; PartId: 10786; Part Status: Active; Price: 0.01; Ratings: AEC-Q200; Resistance: 750 Ohms; Series: RMCF; Size / Dimension: 0.061" L x 0.031" W (1.55mm x 0.80mm); Supplier 1: DigiKey; Supplier Part Number 1: RMCF0603FT750RCT-ND; Supplier Device Package: 0603; Tolerance: ±1%
R6 R7 R10 R11 = SG73S1JTTD1002F: as R13 on sheet AC Detection; Part Number: SG73S1JTTD1002F; Value: 10 kOhms; ComponentLink1Description: Datasheet; ComponentLink1URL: http://www.koaspeer.com/catimages/Products/SG73S/SG73S.pdf; ComponentLink2Description: DigiKey Link; ComponentLink2URL: https://www.digikey.com/en/products/detail/koa-speer-electronics-inc/SG73S1JTTD1002F/10279969; Composition: Thick Film; Device Package: 0603 (1608 Metric); Features: Automotive AEC-Q200, Moisture Resistant, Pulse Withstanding; Height - Seated (Max): 0.022" (0.55mm); LastUpdated: 6/13/2023 8:14:59 PM; Lifecycle Status: Active; Minimum Order: 1; Number of Terminations: 2; Operating Temperature: -55°C ~ 155°C; Package / Case: 0603 (1608 Metric); Packaging: TapeAndReel; PartId: 5386; Part Status: Active; Price: 0.01; Ratings: AEC-Q200; Resistance: 10 kOhms; Series: SG73S; Size / Dimension: 0.063" L x 0.031" W (1.60mm x 0.80mm); Supplier 1: DigiKey; Supplier Part Number 1: 2019-SG73S1JTTD1002FCT-ND; Supplier Device Package: 0603; Tolerance: ±1%

## Sheet AC Connectors.SchDoc: AC Output Connectors
size A4; DocumentNumber: 7; SheetNumber: 7; SheetTotal: 9
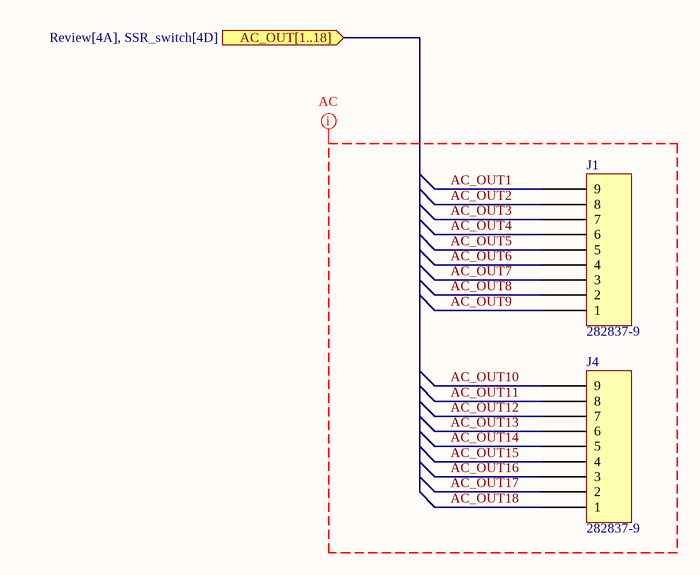
[diagram p7: AC Connectors.SchDoc]

### Parts
J1  282837-9  [TE 282837-9]
J4  282837-9  [TE 282837-9]

### Ports
AC_OUT[1..18] (in, see Review[4A], SSR_switch[4D])

### Nets
AC_OUT1: J1.9
AC_OUT2: J1.8
AC_OUT3: J1.7
AC_OUT4: J1.6
AC_OUT5: J1.5
AC_OUT6: J1.4
AC_OUT7: J1.3
AC_OUT8: J1.2
AC_OUT9: J1.1
AC_OUT10: J4.9
AC_OUT11: J4.8
AC_OUT12: J4.7
AC_OUT13: J4.6
AC_OUT14: J4.5
AC_OUT15: J4.4
AC_OUT16: J4.3
AC_OUT17: J4.2
AC_OUT18: J4.1

### Layout directives
net class AC: AC_OUT1, AC_OUT2, AC_OUT3, AC_OUT4, AC_OUT5, AC_OUT6, AC_OUT7, AC_OUT8, AC_OUT9, AC_OUT10, AC_OUT11, AC_OUT12, AC_OUT13, AC_OUT14, AC_OUT15, AC_OUT16, AC_OUT17, AC_OUT18

### Notes on the sheet
- Title
- Size:
- Date:
- A4
- Number:
- Time:
- Revision:
- Sheet
- of
- File:

### Library data of the parts
J1 J4 = 282837-9: TERM BLK 9P SIDE ENT 5.08MM PCB; Manufacturer: TE Connectivity AMP Connectors; Current: 13.5 A; Mating Orientation: Horizontal with Board; Number of Levels: 1; Pitch: 0.200" (5.08mm); Positions Per Level: 9; Voltage: 300 V; Wire Gauge: 16-28 AWG; Wire Termination: Screw - Rising Cage Clamp; Part Number: 282837-9; Color: Green; ComponentLink1Description: Datasheet; ComponentLink1URL: https://www.te.com/commerce/DocumentDelivery/DDEController?Action=srchrtrv&DocNm=282837&DocType=Customer+Drawing&DocLang=English; ComponentLink2Description: DigiKey Link; ComponentLink2URL: https://www.digikey.com/en/products/detail/te-connectivity-amp-connectors/282837-9/1136739; Features: Interlocking (Side); LastUpdated: 6/21/2022 3:02:09 PM; Lifecycle Status: Active; Minimum Order: 1; Mounting Type: Through Hole; Packaging: Bulk; Part Status: Active; Price: 2.30; Series: Buchanan; Supplier 1: DigiKey; Supplier Part Number 1: A135915-ND

## Sheet Connectors.SchDoc: IO Connector
size A4; DocumentNumber: 2; SheetNumber: 2; SheetTotal: 10
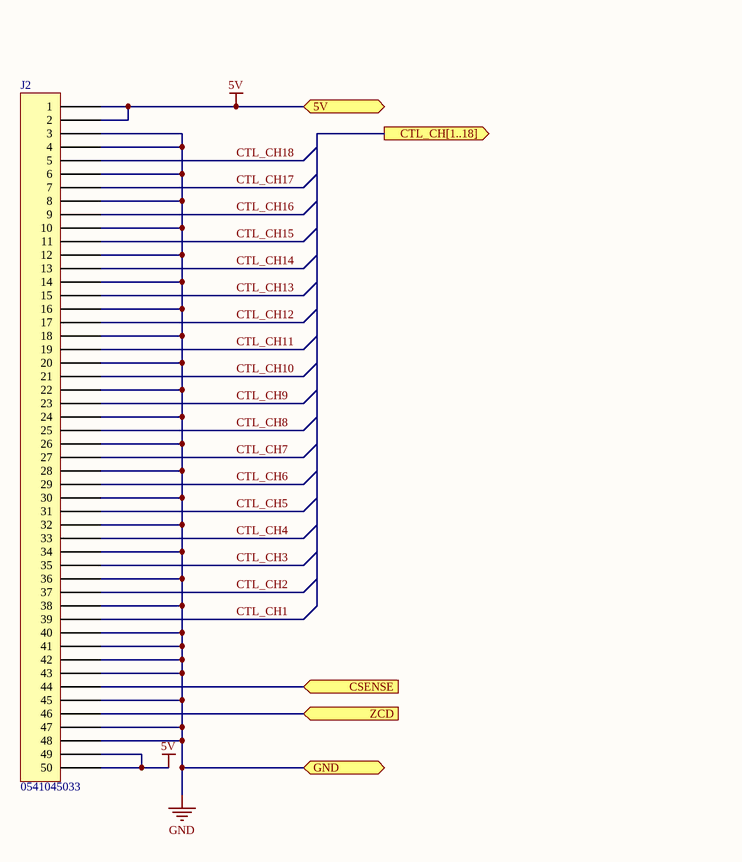
[diagram p8: Connectors.SchDoc]

### Parts
J2  0541045033  [MOLEX 0541045033]

### Ports
5V (bidir, see Review[2B], AC DC Powersupply[3B], AC Detection[1A], Opto[1B], SSR Control[1A], Supply 5V[2B], Supply 15V[2B]), CSENSE (in, see Review[2B], AC Detection[1B]), CTL_CH[1..18] (out, see Review[2B], SSR Control[1A]), GND (bidir, see Review[2B], AC DC Powersupply[3B], AC Detection[1A], Supply 5V[2C], Supply 15V[2C]), ZCD (in, see Review[2B], AC Detection[4D])

### Nets
5V: J2.1 J2.2 J2.49 J2.50 ; port 5V
GND: J2.3 J2.4 J2.6 J2.8 J2.10 J2.12 J2.14 J2.16 J2.18 J2.20 J2.22 J2.24 J2.26 J2.28 J2.30 J2.32 J2.34 J2.36 J2.38 J2.40 J2.41 J2.42 J2.43 J2.45 J2.47 J2.48 ; port GND
CSENSE: J2.44 ; port CSENSE
CTL_CH1: J2.39
CTL_CH2: J2.37
CTL_CH3: J2.35
CTL_CH4: J2.33
CTL_CH5: J2.31
CTL_CH6: J2.29
CTL_CH7: J2.27
CTL_CH8: J2.25
CTL_CH9: J2.23
CTL_CH10: J2.21
CTL_CH11: J2.19
CTL_CH12: J2.17
CTL_CH13: J2.15
CTL_CH14: J2.13
CTL_CH15: J2.11
CTL_CH16: J2.9
CTL_CH17: J2.7
CTL_CH18: J2.5
ZCD: J2.46 ; port ZCD

### Notes on the sheet
- Title
- Size:
- Date:
- A4
- Number:
- Time:
- Revision:
- Sheet
- of
- File:

### Library data of the parts
J2 = 0541045033: CONN FFC TOP 50POS 0.50MM R/A; Manufacturer: Molex; Actuator Material: Polyphenylene Sulfide (PPS), Glass Filled; Cable End Type: Straight, Tapered; Connector/Contact Type: Contacts, Top; FFC, FCB Thickness: 0.30mm; Flat Flex Type: FFC, FPC; Locking Feature: Slide Lock; Material Flammability Rating: UL94 V-0; Number of Positions: 50; Pitch: 0.020" (0.50mm); Part Number: 0541045033; ComponentLink1Description: Datasheet; ComponentLink1URL: https://www.molex.com/pdm_docs/sd/541044633_sd.pdf; ComponentLink2Description: DigiKey Link; ComponentLink2URL: https://www.digikey.com/en/products/detail/molex/0541045033/4444679; Contact Finish: Tin Bismuth; Contact Material: Phosphor Bronze; Features: Solder Retention, Zero Insertion Force (ZIF); Height Above Board: 0.079" (2.00mm); Housing Material: Polyamide (PA), Nylon, Glass Filled; LastUpdated: 6/14/2023 5:52:56 PM; Lifecycle Status: Active; Minimum Order: 1; Mounting Type: Surface Mount, Right Angle; Operating Temperature: -40°C ~ 85°C; Packaging: TapeAndReel; Part Status: Active; Price: 1.69; Series: Easy-On 54104; Supplier 1: DigiKey; Supplier Part Number 1: WM11093CT-ND; Termination: Solder